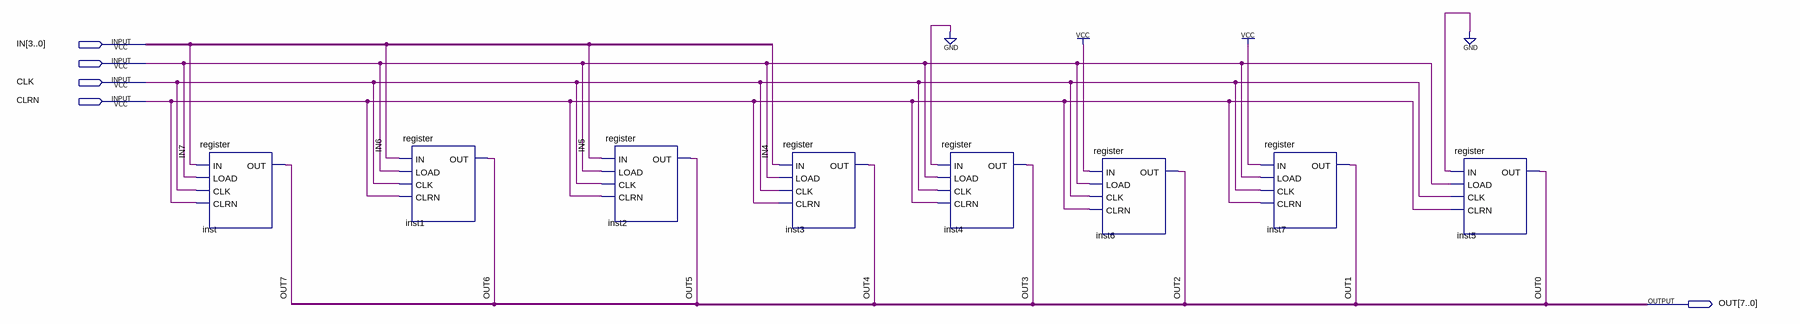
[diagram p0: schematic sheet]
// Quartus schematic reg8b1st.bdf as structural Verilog: 8 symbols, 5 pins
module reg8b1st (
  input  [3:0] IN,
  input  CLK,
  input  CLRN,
  output [7:0] OUT
);

  wire IN4, IN5, IN6, IN7, undriven;

  register inst (.IN(IN7), .LOAD(undriven), .CLK(CLK), .CLRN(CLRN), .OUT(OUT[7]));
  register inst1 (.IN(IN6), .LOAD(undriven), .CLK(CLK), .CLRN(CLRN), .OUT(OUT[6]));
  register inst2 (.IN(IN5), .LOAD(undriven), .CLK(CLK), .CLRN(CLRN), .OUT(OUT[5]));
  register inst3 (.IN(IN4), .LOAD(undriven), .CLK(CLK), .CLRN(CLRN), .OUT(OUT[4]));
  register inst4 (.IN(1'b0), .LOAD(undriven), .CLK(CLK), .CLRN(CLRN), .OUT(OUT[3]));
  register inst6 (.IN(1'b1), .LOAD(undriven), .CLK(CLK), .CLRN(CLRN), .OUT(OUT[2]));
  register inst7 (.IN(1'b1), .LOAD(undriven), .CLK(CLK), .CLRN(CLRN), .OUT(OUT[1]));
  register inst5 (.IN(1'b0), .LOAD(undriven), .CLK(CLK), .CLRN(CLRN), .OUT(OUT[0]));
endmodule
